# Altium schematic sheet RampPLLWaveyRadar.SchDoc: Ramp PLL WaveyRadar Schematic
size Letter; Author: Will Vu; CompanyName: Raccoon Wireless; DrawnBy: Will Vu, Raccoon Wireless; Engineer: Will Vu; Organization: Raccoon Wireless; DocumentNumber: 2-03; Revision: 2; SheetNumber: 3; SheetTotal: 15
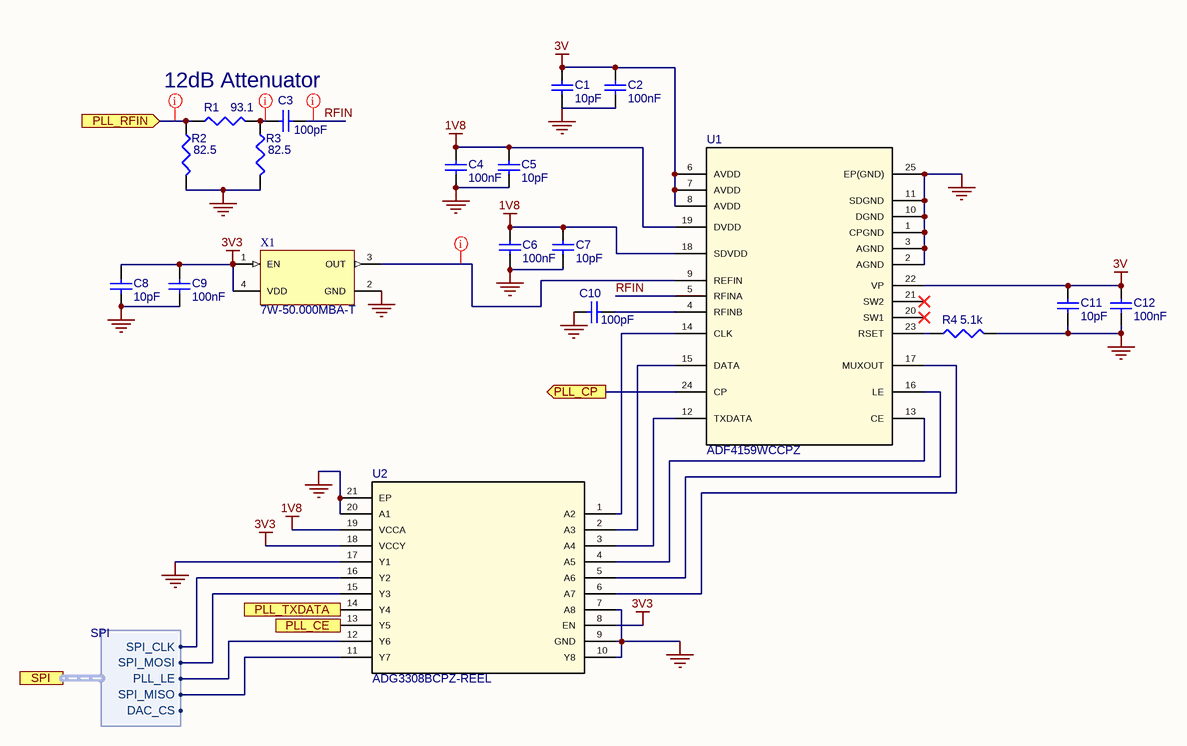
[diagram p0: RampPLLWaveyRadar.SchDoc]

## Parts
C1  value 10pF  [CAPC1005X55X30LL05T10]  (hidden comment: Capacitor 10 pF +/- 0.25 pF 50 V 0402)
C2  value 100nF  [CAPC0402(1005)60_L]  (hidden comment: Capacitor 100nF +/-20% 10V 0402)
C3  value 100pF  [CAPC1005X56X25LL10T15]  (hidden comment: 04023A101JAT2A)
C4  value 100nF  [CAPC0402(1005)60_L]  (hidden comment: Capacitor 100nF +/-20% 10V 0402)
C5  value 10pF  [CAPC1005X55X30LL05T10]  (hidden comment: Capacitor 10 pF +/- 0.25 pF 50 V 0402)
C6  value 100nF  [CAPC0402(1005)60_L]  (hidden comment: Capacitor 100nF +/-20% 10V 0402)
C7  value 10pF  [CAPC1005X55X30LL05T10]  (hidden comment: Capacitor 10 pF +/- 0.25 pF 50 V 0402)
C8  value 10pF  [CAPC1005X55X30LL05T10]  (hidden comment: Capacitor 10 pF +/- 0.25 pF 50 V 0402)
C9  value 100nF  [CAPC0402(1005)60_L]  (hidden comment: Capacitor 100nF +/-20% 10V 0402)
C10  value 100pF  [CAPC1005X56X25LL10T15]  (hidden comment: 04023A101JAT2A)
C11  value 10pF  [CAPC1005X55X30LL05T10]  (hidden comment: Capacitor 10 pF +/- 0.25 pF 50 V 0402)
C12  value 100nF  [CAPC0402(1005)60_L]  (hidden comment: Capacitor 100nF +/-20% 10V 0402)
R1  value 93.1  [RESC1005X40X25LL10T10]  (hidden comment: CR0402-FX-93R1GLF)
R2  value 82.5  [RESC1005X40X25NL05T05]  (hidden comment: ERJ-2RKF82R5X)
R3  value 82.5  [RESC1005X40X25NL05T05]  (hidden comment: ERJ-2RKF82R5X)
R4  value 5.1k  [RESC1005X40X25NL05T05]  (hidden comment: ERJ-2RKF5101X)
U1  ADF4159WCCPZ  [CP_24_10]
U2  ADG3308BCPZ-REEL  [CP_20_1_ADI]
X1  7W-50.000MBA-T  [TXC-L500W700H130-4_V]

## Ports
PLL_CE (in), PLL_CP (out), PLL_RFIN (in), PLL_TXDATA (in), SPI (harness SPI)

## Harnesses
SPI: SPI_MOSI, SPI_CLK, PLL_LE, SPI_MISO, DAC_CS

## Nets
1V8: C4.2 C5.2 C6.2 C7.2 U1.18(SDVDD) U1.19(DVDD) U2.19(VCCA)
3V: C1.2 C2.2 C11.2 C12.2 U1.6(AVDD) U1.7(AVDD) U1.8(AVDD) U1.22(VP)
3V3: C8.2 C9.2 U2.8(EN) U2.18(VCCY) X1.1(EN) X1.4(VDD)
GND: C1.1 C2.1 C4.1 C5.1 C6.1 C7.1 C8.1 C9.1 C10.1 C11.1 C12.1 R2.2 R3.2 R4.2 U1.1(CPGND) U1.2(AGND) U1.3(AGND) U1.10(DGND) U1.11(SDGND) U1.25(EP(GND)) U2.7(A8) U2.9(GND) U2.10(Y8) U2.17(Y1) U2.20(A1) U2.21(EP) X1.2(GND)
PLL_CE: U2.13(Y5) ; port PLL_CE
PLL_CP: U1.24(CP) ; port PLL_CP
PLL_RFIN: R1.1 R2.1 ; port PLL_RFIN
PLL_TXDATA: U2.14(Y4) ; port PLL_TXDATA
RFIN: C3.2 U1.5(RFINA)
NetC3_1: C3.1 R1.2 R3.1
NetC10_2: C10.2 U1.4(RFINB)
NetR4_1: R4.1 U1.23(RSET)
NetU1_9: U1.9(REFIN) X1.3(OUT)
NetU1_12: U1.12(TXDATA) U2.3(A4)
NetU1_13: U1.13(CE) U2.4(A5)
NetU1_14: U1.14(CLK) U2.1(A2)
NetU1_15: U1.15(DATA) U2.2(A3)
NetU1_16: U1.16(LE) U2.5(A6)
NetU1_17: U1.17(MUXOUT) U2.6(A7)
NetU2_11: U2.11(Y7) ; port SPI.SPI_MISO
NetU2_12: U2.12(Y6) ; port SPI.PLL_LE
NetU2_15: U2.15(Y3) ; port SPI.SPI_MOSI
NetU2_16: U2.16(Y2) ; port SPI.SPI_CLK

Not connected (* = marked no-connect by the designer): U1 20(SW1)* 21(SW2)*

## Layout directives
net class RF: NetC3_1, NetU1_9, PLL_RFIN, RFIN

## Notes on the sheet
- 12dB Attenuator
- /

## Library data of the parts
C1 C5 C7 C8 C11 = CMP-001-00011-7: Chip Capacitor, 10 pF, +/- 0.25 pF, 50 V, 0402 (1005 Metric); Voltage Rating: 50V; Tolerance: 0.25%; Capacitor Type: Ceramic; Mounting Technology: SM; Pins: 2; Case/Package: 0402; Min Operating Temperature: -55°C; RoHS Compliant: True; Max Operating Temperature: 125°C
C2 C4 C6 C9 C12 = CMP-001-00061-4: Chip Capacitor, 100nF +/-20%, 10V, 0402, Thickness 0.6 mm; Tolerance: 20%; Mounting Technology: SMT; Voltage Rating: 10V; Max Operating Temperature: 85°C; Pins: 2; Case/Package: 0402; Min Operating Temperature: -55°C
C3 C10 = CMP-001-00083-2: AVX - 04023A101JAT2A - SMD Multilayer Ceramic Capacitor, 100 pF, 25 V, 0402 [1005 Metric], ± 5%, C0G / NP0, AVX 0402 MLCC
R1 = CMP-009-00196-1: Thick Film Resistors 93.1OHM 1/16WATT 1%
R2 R3 = CMP-009-00195-1: PANASONIC ELECTRONIC COMPONENTS         ERJ2RKF82R5X             SMD Chip Resistor, Thick Film, 82.5 ohm, 50 V, 0402 [1005 Metric], 100 mW,  1%, ERJ2R Series
R4 = CMP-009-00180-5: PANASONIC - ERJ2RKF5101X - SMD Chip Resistor, 0402 [1005 Metric], 5.1 kohm, ERJ2R Series, 50 V, Thick Film, 100 mW, 5.1k ohm
U1 = ADF4159WCCPZ: No Description Available
U2 = CMP-061-000000-1: No Description Available; Vendor: Analog Devices Inc; Built_By: EMA_UL_Team; SourceLibrary: Analog_2012-01-01_7; Copyright: Copyright (C) 2021 Accelerated Designs. All rights reserved; RefDes: RefDes; Type: DEV; Manufacturer_Part_Number: ADG3308BCPZ-REEL; Design Item ID: ADG3308BCPZ-REEL; Source: 2021-07-05_15-07-55.SchLib
X1 = CMP-003-00030-2: OSCILLATOR, 50 MHz, FULL REEL; Product Range:7W Series; Frequency Nom:50MHz; Frequency Stability + / -:25ppm; Supply Voltage Nom:3.3V; Oscillator Case:SMD, 7mm x 5mm; Oscillator Output Compatibility:CMOS; Frequency:50MHz ;RoHS Compliant: Yes; Value: 50MHz